# Altium schematic sheet LED_ROWS.SchDoc: LED Cube 8x8x8 - LED
size A4; Author: Luka Penger; CompanyName: L. Penger; DrawnBy: Luka Penger; Organization: L. Penger; Address1: Luka Penger; Address2: http://lukapenger.eu; Address3: Software & Hardware; Address4: Development; DocumentNumber: 2; Revision: 4.1.0; SheetNumber: 2; SheetTotal: 3; DocumentName: LED ROWS; ProjectName: LED Cube 8x8x8
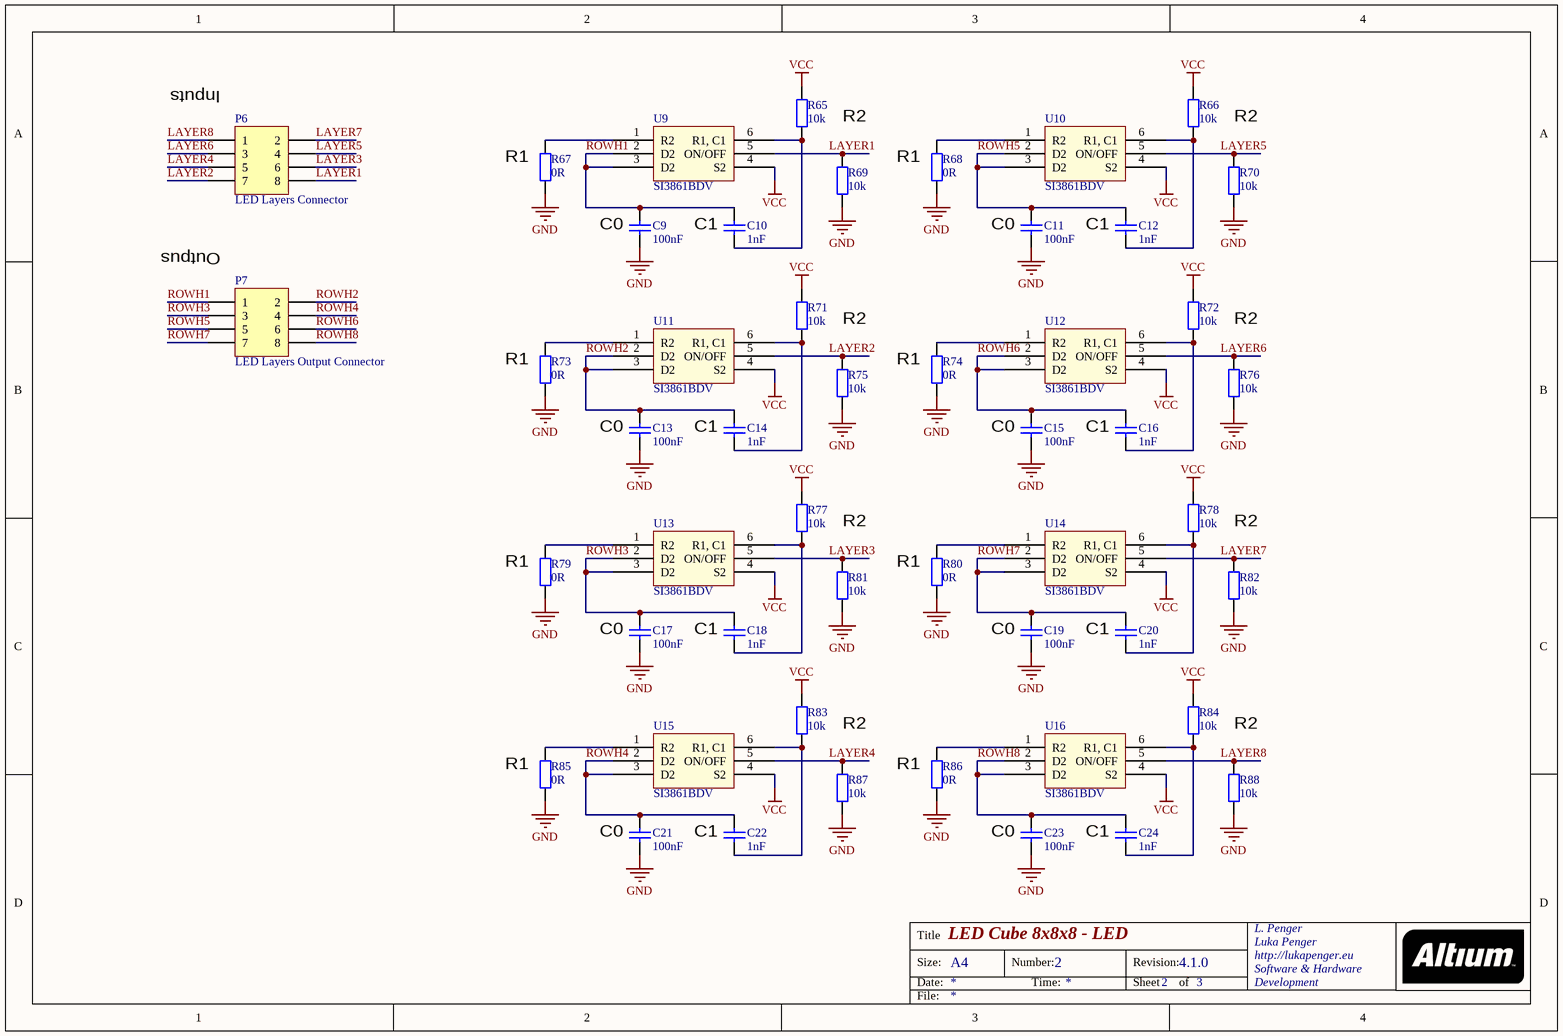
[diagram p0: LED_ROWS.SchDoc]

## Parts
C9  100nF  [1608[0603]]
C10  1nF  [1608[0603]]
C11  100nF  [1608[0603]]
C12  1nF  [1608[0603]]
C13  100nF  [1608[0603]]
C14  1nF  [1608[0603]]
C15  100nF  [1608[0603]]
C16  1nF  [1608[0603]]
C17  100nF  [1608[0603]]
C18  1nF  [1608[0603]]
C19  100nF  [1608[0603]]
C20  1nF  [1608[0603]]
C21  100nF  [1608[0603]]
C22  1nF  [1608[0603]]
C23  100nF  [1608[0603]]
C24  1nF  [1608[0603]]
P6  LED Layers Connector  [IDC-2x4]
P7  LED Layers Output Connector  [IDC-2x4]
R65  10k  [1608[0603]]
R66  10k  [1608[0603]]
R67  0R  [1608[0603]]
R68  0R  [1608[0603]]
R69  10k  [1608[0603]]
R70  10k  [1608[0603]]
R71  10k  [1608[0603]]
R72  10k  [1608[0603]]
R73  0R  [1608[0603]]
R74  0R  [1608[0603]]
R75  10k  [1608[0603]]
R76  10k  [1608[0603]]
R77  10k  [1608[0603]]
R78  10k  [1608[0603]]
R79  0R  [1608[0603]]
R80  0R  [1608[0603]]
R81  10k  [1608[0603]]
R82  10k  [1608[0603]]
R83  10k  [1608[0603]]
R84  10k  [1608[0603]]
R85  0R  [1608[0603]]
R86  0R  [1608[0603]]
R87  10k  [1608[0603]]
R88  10k  [1608[0603]]
U9  SI3861BDV  [TSOP 6]
U10  SI3861BDV  [TSOP 6]
U11  SI3861BDV  [TSOP 6]
U12  SI3861BDV  [TSOP 6]
U13  SI3861BDV  [TSOP 6]
U14  SI3861BDV  [TSOP 6]
U15  SI3861BDV  [TSOP 6]
U16  SI3861BDV  [TSOP 6]

## Nets
GND: C9.2 C11.2 C13.2 C15.2 C17.2 C19.2 C21.2 C23.2 R67.2 R68.2 R69.1 R70.1 R73.2 R74.2 R75.1 R76.1 R79.2 R80.2 R81.1 R82.1 R85.2 R86.2 R87.1 R88.1
VCC: R65.2 R66.2 R71.2 R72.2 R77.2 R78.2 R83.2 R84.2 U9.4(S2) U10.4(S2) U11.4(S2) U12.4(S2) U13.4(S2) U14.4(S2) U15.4(S2) U16.4(S2)
LAYER1: P6.8 R69.2 U9.5(ON/OFF)
LAYER2: P6.7 R75.2 U11.5(ON/OFF)
LAYER3: P6.6 R81.2 U13.5(ON/OFF)
LAYER4: P6.5 R87.2 U15.5(ON/OFF)
LAYER5: P6.4 R70.2 U10.5(ON/OFF)
LAYER6: P6.3 R76.2 U12.5(ON/OFF)
LAYER7: P6.2 R82.2 U14.5(ON/OFF)
LAYER8: P6.1 R88.2 U16.5(ON/OFF)
ROWH1: C9.1 C10.1 P7.1 U9.2(D2) U9.3(D2)
ROWH2: C13.1 C14.1 P7.2 U11.2(D2) U11.3(D2)
ROWH3: C17.1 C18.1 P7.3 U13.2(D2) U13.3(D2)
ROWH4: C21.1 C22.1 P7.4 U15.2(D2) U15.3(D2)
ROWH5: C11.1 C12.1 P7.5 U10.2(D2) U10.3(D2)
ROWH6: C15.1 C16.1 P7.6 U12.2(D2) U12.3(D2)
ROWH7: C19.1 C20.1 P7.7 U14.2(D2) U14.3(D2)
ROWH8: C23.1 C24.1 P7.8 U16.2(D2) U16.3(D2)
NetC10_2: C10.2 R65.1 U9.6(R1,_C1)
NetC12_2: C12.2 R66.1 U10.6(R1,_C1)
NetC14_2: C14.2 R71.1 U11.6(R1,_C1)
NetC16_2: C16.2 R72.1 U12.6(R1,_C1)
NetC18_2: C18.2 R77.1 U13.6(R1,_C1)
NetC20_2: C20.2 R78.1 U14.6(R1,_C1)
NetC22_2: C22.2 R83.1 U15.6(R1,_C1)
NetC24_2: C24.2 R84.1 U16.6(R1,_C1)
NetR67_1: R67.1 U9.1(R2)
NetR68_1: R68.1 U10.1(R2)
NetR73_1: R73.1 U11.1(R2)
NetR74_1: R74.1 U12.1(R2)
NetR79_1: R79.1 U13.1(R2)
NetR80_1: R80.1 U14.1(R2)
NetR85_1: R85.1 U15.1(R2)
NetR86_1: R86.1 U16.1(R2)

## Notes on the sheet
- (near P6) Inputs
- (near R67) R1
- R2
- (near R68) R1
- (near P7) Outpus
- (near C9) C0
- (near C10) C1
- (near C11) C0
- (near C12) C1
- (near R73) R1
- (near R74) R1
- (near C13) C0
- (near C14) C1
- (near C15) C0
- (near C16) C1
- (near R79) R1
- (near R80) R1
- (near C17) C0
- (near C18) C1
- (near C19) C0
- (near C20) C1
- (near R85) R1
- (near R86) R1
- (near C21) C0
- (near C22) C1
- (near C23) C0
- (near C24) C1
- Title
- Size:
- Date:
- A4
- Number:
- Time:
- Revision:
- Sheet
- of
- File:

## Library data of the parts
C9-C24 = Cap: Capacitor; Value: 100pF; Published: 8-Jun-2000; LatestRevisionDate: 17-Jul-2002; LatestRevisionNote: Re-released for DXP Platform.; PackageReference: RAD-0.3; Publisher: Altium Limited; PackageDescription: Radial Cap, Thru-Hole; 2 Leads; 0.3 in Pin Spacing
P6 P7 = Header 4X2: Header, 4-Pin, Dual row; LatestRevisionDate: 17-Jul-2002; LatestRevisionNote: Re-released for DXP Platform.; Publisher: Altium Limited
R65-R88 = Res2: Resistor; Value: 1K; Published: 8-Jun-2000; LatestRevisionDate: 17-Jul-2002; LatestRevisionNote: Re-released for DXP Platform.; PackageReference: AXIAL-0.4; Publisher: Altium Limited; PackageDescription: Axial Device, Thru-Hole; 2 Leads; 0.4 in Pin Spacing
U9-U16 = SI3861BDV: 4.5 - 20V 2.3A Load Switch